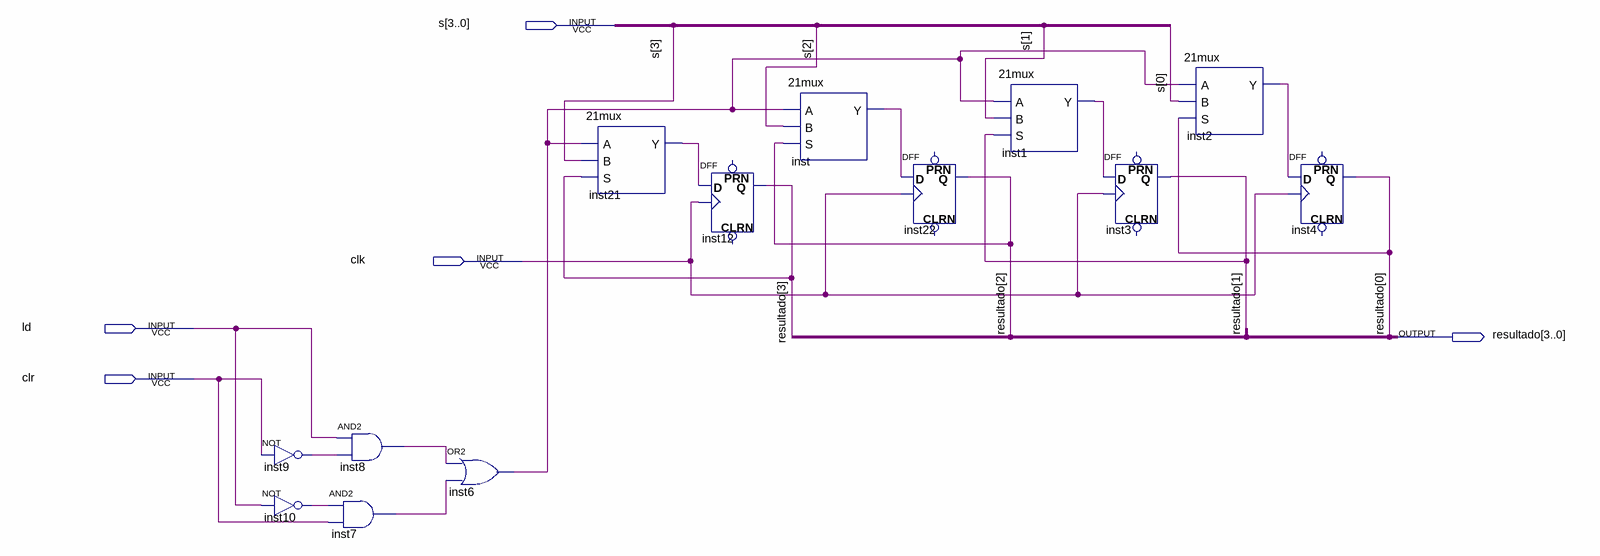
[diagram p0: schematic sheet]
// Quartus schematic Resultado.bdf as structural Verilog: 13 symbols, 5 pins
module Resultado (
  input  [3:0] s,
  input  clk,
  input  ld,
  input  clr,
  output [3:0] resultado
);

  wire inst1_y, inst2_y, inst6_out, inst7_out, inst8_out, inst9_out, inst10_out, inst21_y, inst_y;

  not inst9 (inst9_out, clr);
  not inst10 (inst10_out, ld);
  and inst8 (inst8_out, ld, inst9_out);
  and inst7 (inst7_out, inst10_out, clr);
  or inst6 (inst6_out, inst8_out, inst7_out);
  \21mux  inst21 (.A(inst6_out), .B(s[3]), .S(resultado[3]), .Y(inst21_y));
  DFF inst12 (.CLK(clk), .D(inst21_y), .Q(resultado[3]));  // open: CLRN, PRN
  \21mux  inst (.A(inst6_out), .B(s[2]), .S(resultado[2]), .Y(inst_y));
  DFF inst22 (.CLK(clk), .D(inst_y), .Q(resultado[2]));  // open: CLRN, PRN
  \21mux  inst1 (.A(inst6_out), .B(s[1]), .S(resultado[1]), .Y(inst1_y));
  DFF inst3 (.CLK(clk), .D(inst1_y), .Q(resultado[1]));  // open: CLRN, PRN
  \21mux  inst2 (.A(inst6_out), .B(s[0]), .S(resultado[0]), .Y(inst2_y));
  DFF inst4 (.CLK(clk), .D(inst2_y), .Q(resultado[0]));  // open: CLRN, PRN
endmodule
